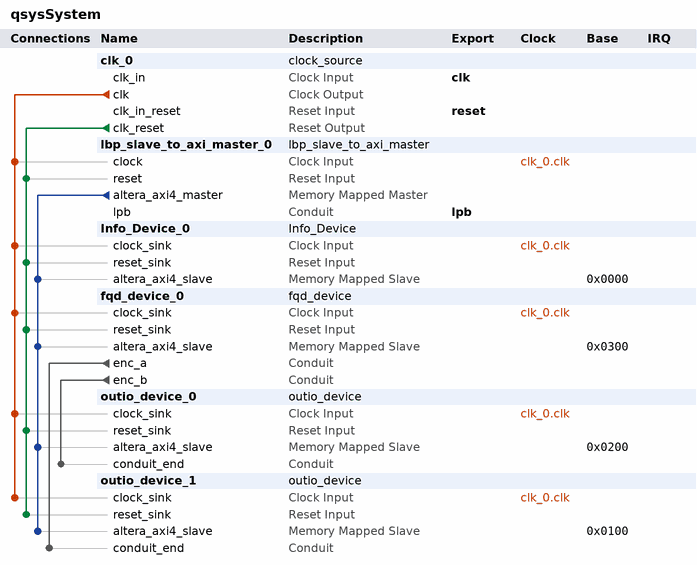
[diagram p0: system contents]
# Platform Designer (Qsys) system qsysSystem, Cyclone II EP2C8F256C8
# Parameters at their usual value, and those the tool derives, are not listed.
package require -exact qsys 13.0
create_system qsysSystem
set_project_property DEVICE_FAMILY {Cyclone II}
set_project_property DEVICE EP2C8F256C8

add_instance clk_0 clock_source 13.0
set_instance_parameter_value clk_0 clockFrequency 50000000

add_instance lbp_slave_to_axi_master_0 lbp_slave_to_axi_master 1.0
set_instance_parameter_value lbp_slave_to_axi_master_0 LPBADDRWIDTH 32
set_instance_parameter_value lbp_slave_to_axi_master_0 LPBDATAWIDTH 32
set_instance_parameter_value lbp_slave_to_axi_master_0 LPBTSIZEWIDTH 3
set_instance_parameter_value lbp_slave_to_axi_master_0 LPBCSWIDTH 2
set_instance_parameter_value lbp_slave_to_axi_master_0 LPBBANKWIDTH 2

add_instance Info_Device_0 Info_Device 1.0
set_instance_parameter_value Info_Device_0 unique_id 1
set_instance_parameter_value Info_Device_0 description 483773092847881376329319
set_instance_parameter_value Info_Device_0 dev_size 896

add_instance fqd_device_0 fqd_device 1.0
set_instance_parameter_value fqd_device_0 number_of_fqds 4
set_instance_parameter_value fqd_device_0 unique_id 4

add_instance outio_device_0 outio_device 1.0
set_instance_parameter_value outio_device_0 number_of_gpios 4
set_instance_parameter_value outio_device_0 unique_id 2

add_instance outio_device_1 outio_device 1.0
set_instance_parameter_value outio_device_1 number_of_gpios 4
set_instance_parameter_value outio_device_1 unique_id 3

# connections
add_connection clk_0.clk fqd_device_0.clock_sink clock
add_connection clk_0.clk Info_Device_0.clock_sink clock
add_connection clk_0.clk lbp_slave_to_axi_master_0.clock clock
add_connection clk_0.clk outio_device_0.clock_sink clock
add_connection clk_0.clk outio_device_1.clock_sink clock
add_connection clk_0.clk_reset fqd_device_0.reset_sink reset
add_connection clk_0.clk_reset Info_Device_0.reset_sink reset
add_connection clk_0.clk_reset lbp_slave_to_axi_master_0.reset reset
add_connection clk_0.clk_reset outio_device_0.reset_sink reset
add_connection clk_0.clk_reset outio_device_1.reset_sink reset
add_connection lbp_slave_to_axi_master_0.altera_axi4_master fqd_device_0.altera_axi4_slave avalon
set_connection_parameter_value lbp_slave_to_axi_master_0.altera_axi4_master/fqd_device_0.altera_axi4_slave baseAddress 0x0300
add_connection lbp_slave_to_axi_master_0.altera_axi4_master Info_Device_0.altera_axi4_slave avalon
set_connection_parameter_value lbp_slave_to_axi_master_0.altera_axi4_master/Info_Device_0.altera_axi4_slave baseAddress 0x0000
add_connection lbp_slave_to_axi_master_0.altera_axi4_master outio_device_0.altera_axi4_slave avalon
set_connection_parameter_value lbp_slave_to_axi_master_0.altera_axi4_master/outio_device_0.altera_axi4_slave baseAddress 0x0200
add_connection lbp_slave_to_axi_master_0.altera_axi4_master outio_device_1.altera_axi4_slave avalon
set_connection_parameter_value lbp_slave_to_axi_master_0.altera_axi4_master/outio_device_1.altera_axi4_slave baseAddress 0x0100
add_connection fqd_device_0.enc_a outio_device_1.conduit_end conduit
add_connection fqd_device_0.enc_b outio_device_0.conduit_end conduit

# exported interfaces
add_interface clk clock sink
set_interface_property clk EXPORT_OF clk_0.clk_in
add_interface reset reset sink
set_interface_property reset EXPORT_OF clk_0.clk_in_reset
add_interface lpb conduit end
set_interface_property lpb EXPORT_OF lbp_slave_to_axi_master_0.lpb

set_interconnect_requirement {$system} qsys_mm.clockCrossingAdapter HANDSHAKE
set_interconnect_requirement {$system} qsys_mm.maxAdditionalLatency 1

save_system qsysSystem.qsys
